# EAGLE design LC Meter PTH (EAGLE 9.6.2)
Assembly variants: DNP
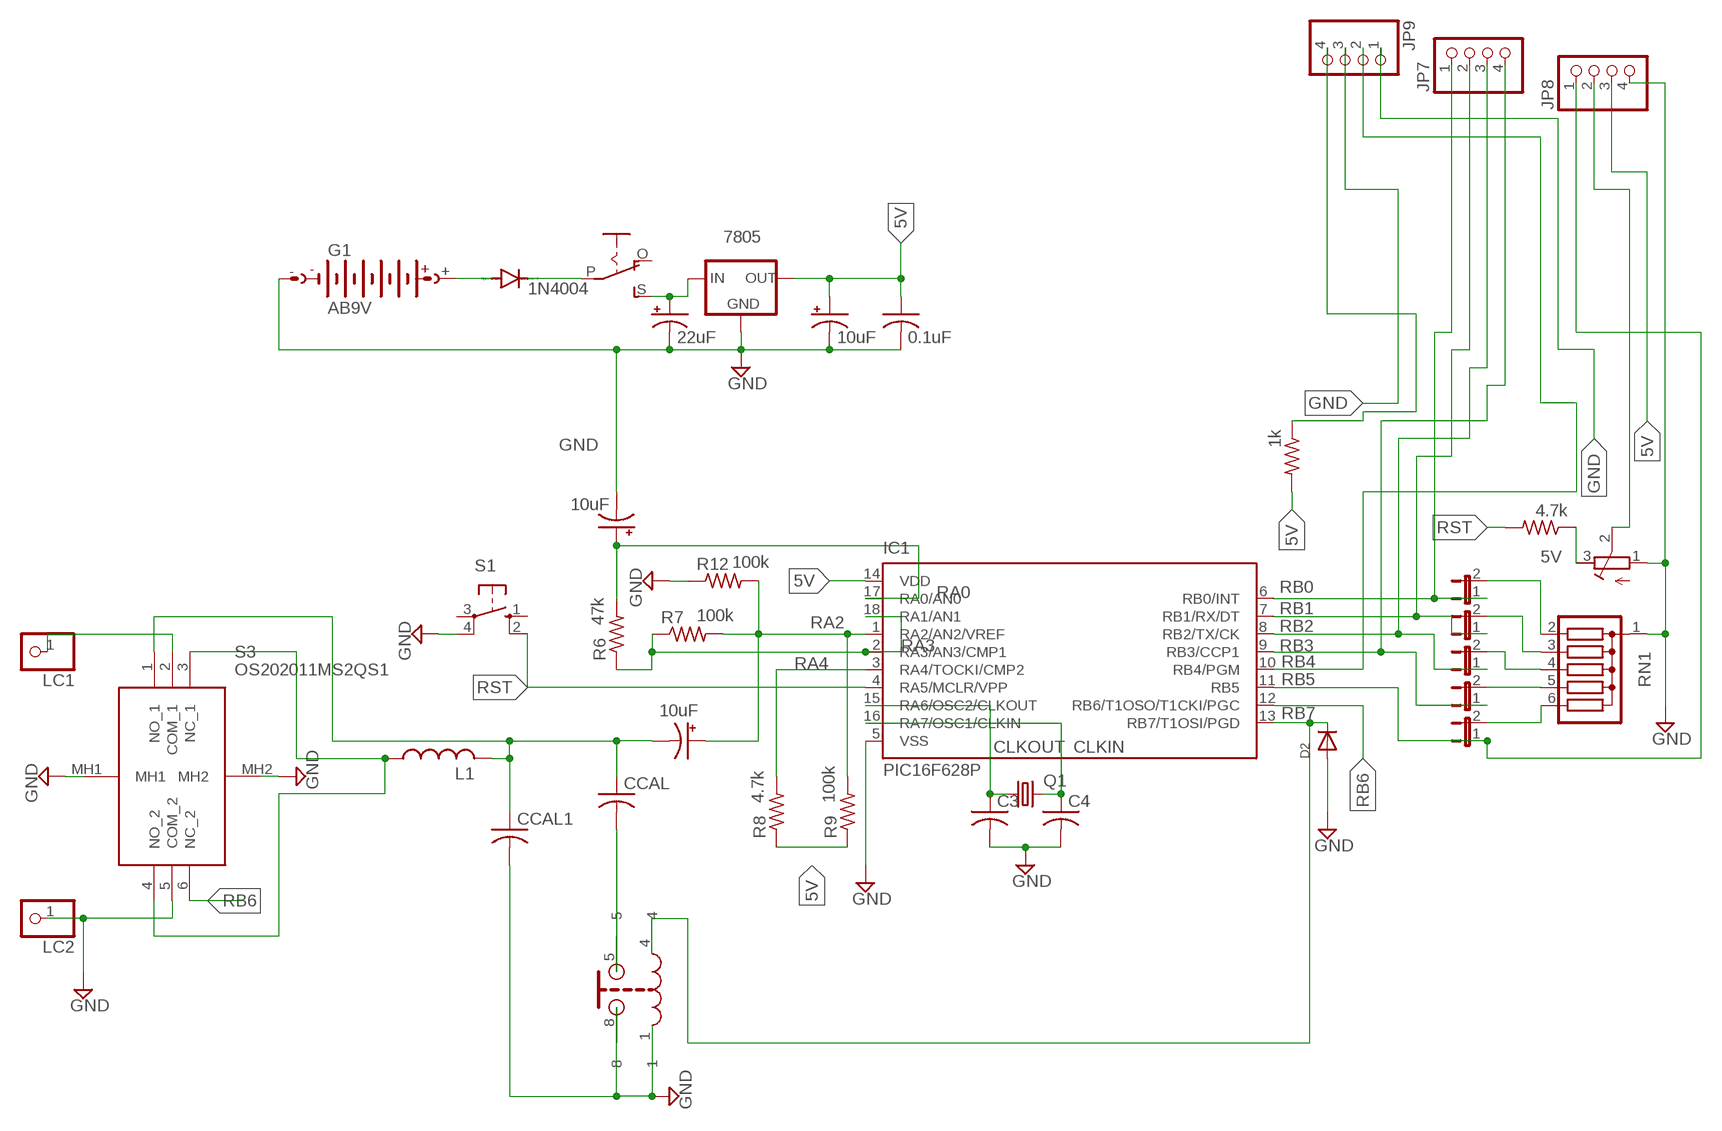
[diagram p0: schematic, sheet 1]

## Parts
C1  22uF  CPOL-USE2.5-7  [E2,5-7]
C2  0.1uF  C-US050-025X075  [C050-025X075]
C3  C-US025-030X050  [C025-030X050]
C4  C-US025-030X050  [C025-030X050]
C5  10uF  CPOL-USE2-4  [E2-4]
C6  10uF  CPOL-USE2-4  [E2-4]
C7  10uF  CPOL-USE2-4  [E2-4]
CCAL  C-US050-035X075  [C050-035X075]
CCAL1  C-US050-035X075  [C050-035X075]
D1  1N4004  [DO41-10]
D2  DIODEDO-1N4148  [DO-1N4148]
G1  AB9V  [AB9V]
IC1  PIC16F628P  [DIL18]
JP1  JP1E  [JP1]
JP2  JP1E  [JP1]
JP3  JP1E  [JP1]
JP4  JP1E  [JP1]
JP5  JP1E  [JP1]
JP7  PINHD-1X4  [1X04]
JP8  PINHD-1X4  [1X04]
JP9  PINHD-1X4  [1X04]
L1  L-US0207/12  [0207/12]
LC1  PINHD-1X1  [1X01]
LC2  PINHD-1X1  [1X01]
Q1  CRYSTALHC49S  [HC49/S]
R1  1k  R-US_0207/7  [0207/7]
R6  47k  R-US_0207/7  [0207/7]
R7  100k  R-US_0207/7  [0207/7]
R8  4.7k  R-US_0207/7  [0207/7]
R9  100k  R-US_0207/7  [0207/7]
R10  4.7k  R-US_0207/7  [0207/7]
R11  R-TRIMM3339P  [RTRIM3339P]
R12  100k  R-US_0207/7  [0207/7]
REED  REEDRELAY  [COTO2204]
RN1  G05R  [SIL6]
S1  10-XX  [B3F-10XX]
S2  EG1218S  [EG1218]
S3  OS202011MS2QS1  [OS202011MS2QS1]
VREG  7805  78XXS  [78XXS]

## Nets
5V: C2.1 C6.+ IC1.14(VDD) JP8.3 R1.2 R8.1 R9.1 R10.1 R11.3(E) VREG.OUT
CLKIN: C4.1 IC1.16(RA7/OSC1/CLKIN) Q1.2
CLKOUT: C3.1 IC1.15(RA6/OSC2/CLKOUT) Q1.1
GND: C1.- C2.2 C3.2 C4.2 C6.- C7.- CCAL1.2 D2.A G1.- IC1.5(VSS) JP8.4 JP9.1 JP9.3 LC2.1 R11.1(A) R12.1 REED.1 REED.8 RN1.1 S1.4(P1) S3.5(COM_2) S3.MH1 S3.MH2 VREG.GND
N$1: JP5.2 RN1.6
N$2: CCAL.2 REED.5
N$3: C1.+ S2.S VREG.IN
N$4: D1.C S2.P
N$5: D1.A G1.+
N$7: C5.- CCAL1.1 CCAL.1 L1.2 S3.1(NO_1)
N$8: JP4.2 RN1.5
N$12: JP3.2 RN1.4
N$13: JP2.2 RN1.3
N$14: JP1.2 RN1.2
N$15: LC1.1 S3.2(COM_1)
N$22: L1.1 S3.3(NC_1) S3.4(NO_2)
N$23: JP8.2 R11.2(S)
N$31: JP9.4 R1.1
RA0: C7.+ IC1.17(RA0/AN0) R6.2
RA2: C5.+ IC1.1(RA2/AN2/VREF) R7.2 R9.2 R12.2
RA3: IC1.2(RA3/AN3/CMP1) IC1.18(RA1/AN1) R6.1 R7.1
RA4: IC1.3(RA4/TOCKI/CMP2) R8.2
RB0: IC1.6(RB0/INT) JP1.1 JP7.1
RB1: IC1.7(RB1/RX/DT) JP2.1 JP7.2
RB2: IC1.8(RB2/TX/CK) JP3.1 JP7.3
RB3: IC1.9(RB3/CCP1) JP4.1 JP7.4
RB4: IC1.10(RB4/PGM) JP9.2
RB5: IC1.11(RB5) JP5.1 JP8.1
RB6: IC1.12(RB6/T1OSO/T1CKI/PGC) S3.6(NC_2)
RB7: D2.C IC1.13(RB7/T1OSI/PGD) REED.4
RST: IC1.4(RA5/MCLR/VPP) R10.2 S1.2(S1)
Unconnected: S1.1(S) S1.3(P) S2.O

## Library data of the parts
C1 = adafruit:CPOL-US: POLARIZED CAPACITOR, American symbol
C2-C4 CCAL CCAL1 = rcl:C-US: CAPACITOR, American symbol; SPICEPREFIX: C
C5-C7 = rcl:CPOL-US: POLARIZED CAPACITOR, American symbol; SPICEPREFIX: C
D1 = diode:1N4004: DIODE general purpose rectifier, 1 A
D2 = adafruit:DIODE: Diode SMADIODE - SMA Surface Mount Package 20V 1A Schottky Diode Digikey: 641-1014-6-ND DO-1N4148 - Through Hole Small Current Diode SOD-123 20V 1 A (.5mV Vf) Schottky Diode - Digikey: MBRX120TPMSCT-ND SOD-323 10V 570mA (.38mV Vf, 3ns) Schottky Diode - Digikey: ZLLS410CT-ND SOD-523 30V 30mA Schottky Diode (RB751S-40TE61) - Digikey: RB751S-40TE61CT-ND SOT23-R/W - SOT23 Package (R = Solder Paste/Reflow Ovens, W = Hand-Soldering) BAT54Film 40V 300mA - Digikey: 497-7162-1-ND
G1 = battery:AB9V: 9-V BATTERY CLIP
IC1 = microchip:PIC16F62*: FLASH-Based 8-Bit CMOS Microcontroller Source: http://ww1.microchip.com/downloads/en/DeviceDoc/40300C.pdf; MF: MICROCHIP; MPN: PIC16F628-04I/P; OC_FARNELL: 9760407; OC_NEWARK: 19C7272
JP1-JP5 = jumper:JP1E: JUMPER
JP7-JP9 = pinhead:PINHD-1X4: PIN HEADER
L1 = rcl:L-US: INDUCTOR, American symbol; SPICEPREFIX: L
LC1 LC2 = adafruit:PINHD-1X1: Pin header 1x1 for 0.1" spacing With round pins
Q1 = adafruit:CRYSTAL: CRYSTAL; OC_FARNELL: 1667008; OC_NEWARK: unknown
R1 R6-R10 R12 = rcl:R-US_: RESISTOR, American symbol; SPICEPREFIX: R
R11 = Custom Parts:R-TRIMM: Trimm resistor; SPICEMODEL: X; SPICEPREFIXL: POT
REED = Custom Parts:REEDRELAY
RN1 = resistor-sil:G05R: SIL RESISTOR; OC_FARNELL: unknown; OC_NEWARK: unknown
S1 = switch-omron:10-XX: OMRON SWITCH; MPN: B3F-1000; OC_FARNELL: 176432; OC_NEWARK: 36M3542
S2 = adafruit:EG1218: SLIDING SWITCH 0.1" spacing through hole, vertical SPDT slide switch http://www.ladyada.net/library/pcb/eaglelibrary.html
S3 = OS202011MS2QS1:OS202011MS2QS1: Switch Slide ON ON DPDT Top Slide 0.1A 12VDC 10000Cycles PC Pins Bracket Mount/Through Hole Bulk Source: Datasheet <https://www.mouser.com/datasheet/2/60/os-1382783.pdf>; ARROW_PART_NUMBER: OS202011MS2QS1; ARROW_PRICE-STOCK: https://www.arrow.com/en/products/os202011ms2qs1/ck; DESCRIPTION: Switch Slide ON ON DPDT Top Slide 0.1A 12VDC 10000Cycles PC Pins Bracket Mount/Through Hole Bulk; HEIGHT: 8.7mm; MANUFACTURER_NAME: C & K COMPONENTS; MANUFACTURER_PART_NUMBER: OS202011MS2QS1; MOUSER_PART_NUMBER: 611-OS202011MS2QS1; MOUSER_PRICE-STOCK: https://www.mouser.co.uk/ProductDetail/CK/OS202011MS2QS1/?qs=86ySKn7Oc5UsfQ5%2FN%252BBOEA%3D%3D
VREG = v-reg:78XXS: VOLTAGE REGULATOR

## Board
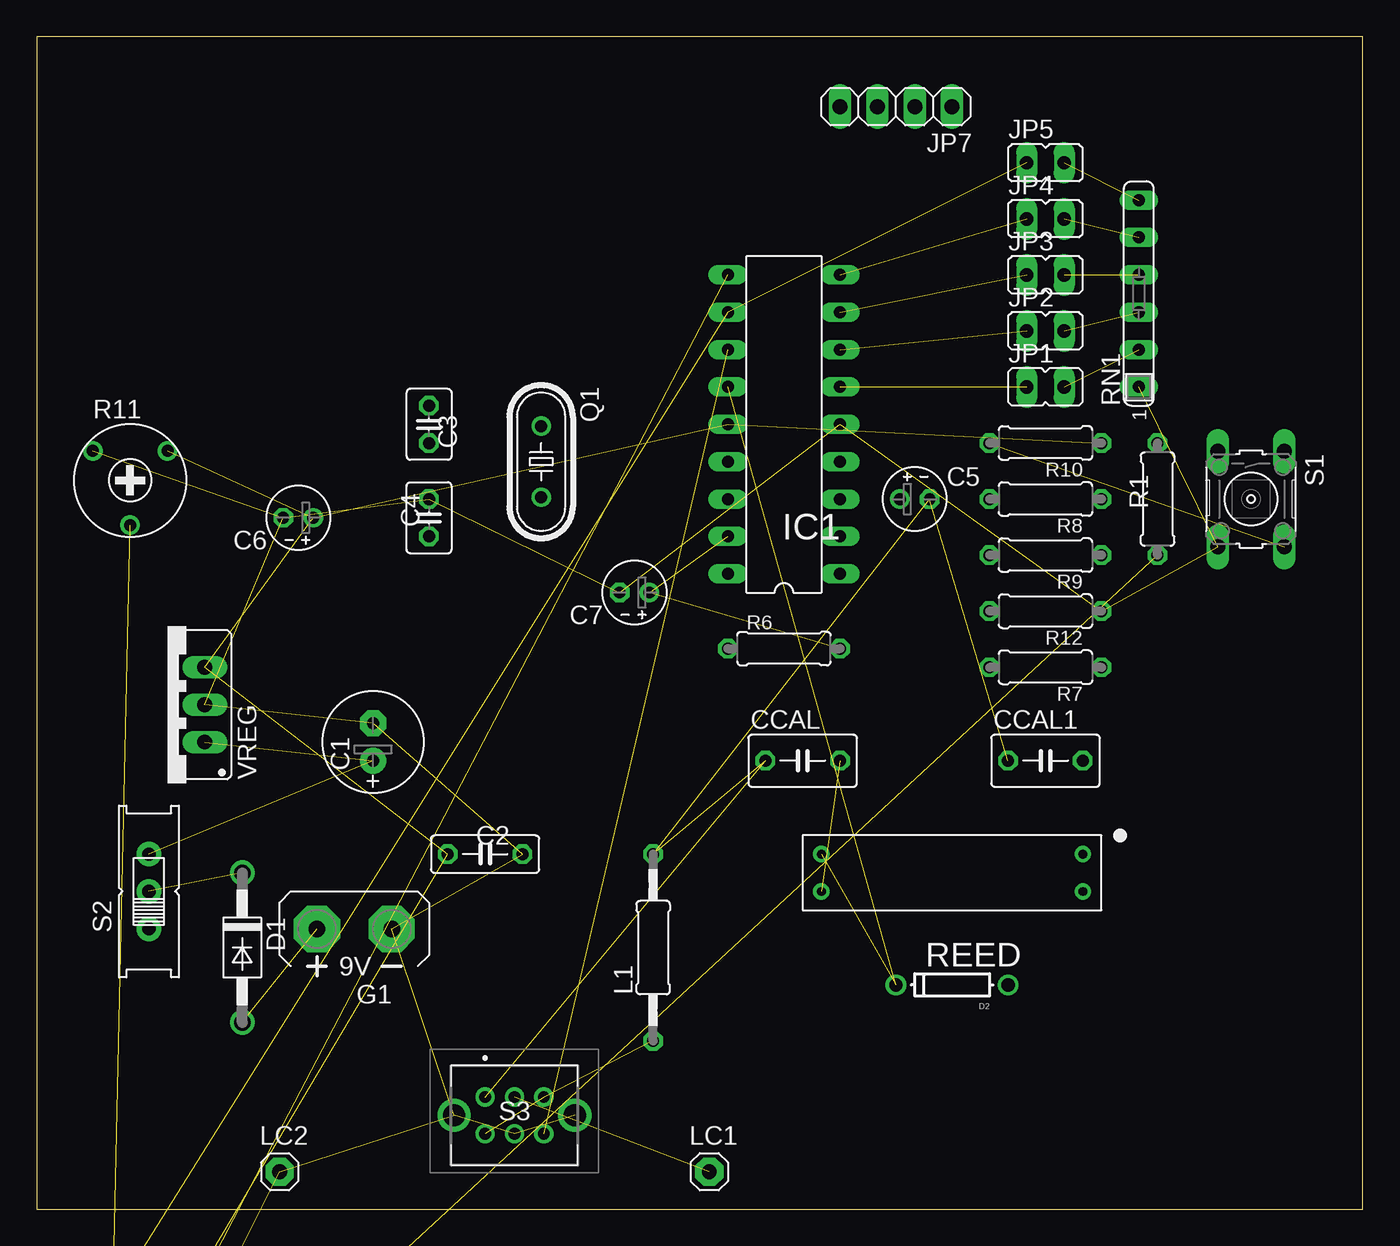
[diagram p1: board, top side]
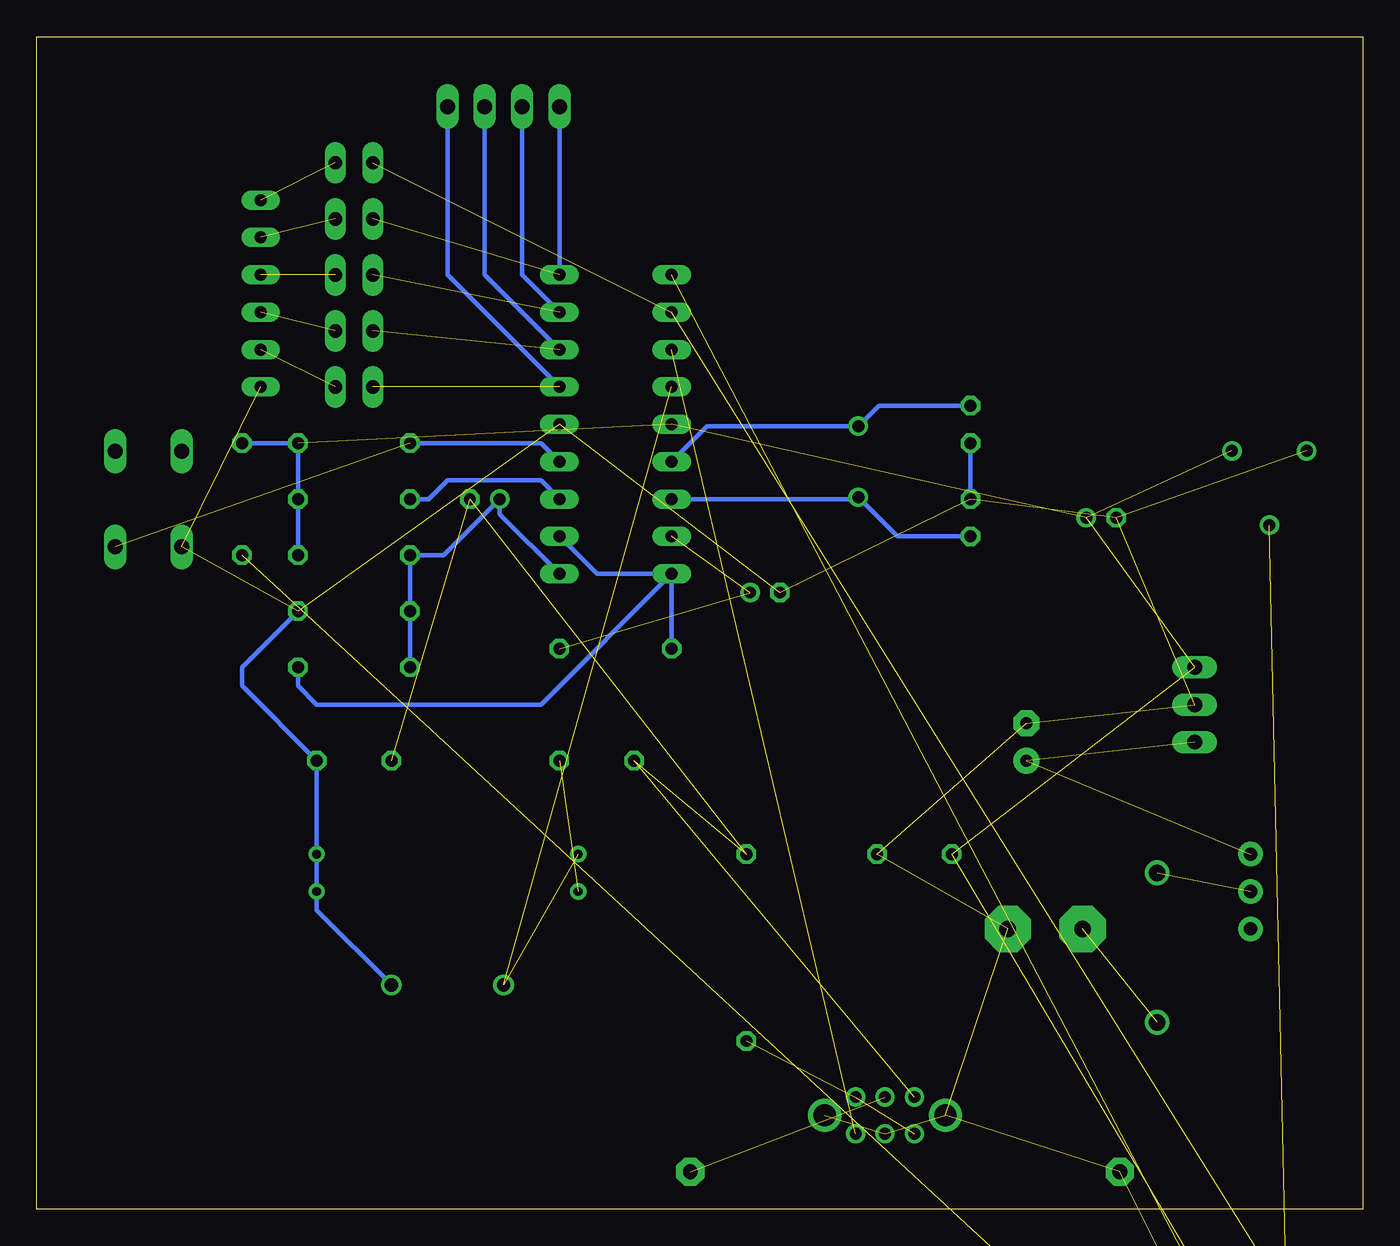
[diagram p2: board, bottom side, seen from below]

Size 90.15 x 79.68 mm. Coordinates in mm from the lower left corner, seen from the top.
Outline: 0,0 90.15,0 90.15,79.68 0,79.68 0,0
Copper layers (1*16): Top 0.035mm / dielectric 1.5mm / Bottom 0.035mm
Design rules "default": minimum track width 6mil, minimum drill 0.35mm, track to track 6mil, track to pad 6mil, pad to pad 6mil, via to via 6mil, smd to smd 6mil, copper to edge 40mil, drill to drill 6mil, minimum pad ring 10mil, minimum via ring 8mil, stop-mask expansion 4mil, vias tented up to drill 0mil, thermal gap 10mil

### Footprints (pad centres in the part's own frame; a part is rotated, then mirrored left to right if it is on the bottom)
E2,5-7 = drill 0.813 pad 1.778: + -1.27,0 | drill 0.813 pad 1.778 octagon: - 1.27,0
C050-025X075 = drill 0.813 octagon: 1 -2.54,0; 2 2.54,0
C025-030X050 = drill 0.813 octagon: 1 -1.27,0; 2 1.27,0
E2-4 = drill 0.813 pad 1.27: + -1.016,0 | drill 0.813 pad 1.27 octagon: - 1.016,0
C050-035X075 = drill 0.813 octagon: 1 -2.54,0; 2 2.54,0
DO41-10 = drill 1.118: A 5.08,0; C -5.08,0
DO-1N4148 = drill 0.9: A -3.81,0; C 3.81,0
AB9V = drill 1.118 pad 3.15 octagon: + 0,2.54; - 0,-2.54
DIL18 = drill 0.813 long: 1 -10.16,-3.81; 2 -7.62,-3.81; 3 -5.08,-3.81; 4 -2.54,-3.81; 5 0,-3.81; 6 2.54,-3.81; 7 5.08,-3.81; 8 7.62,-3.81; 9 10.16,-3.81; 10 10.16,3.81; 11 7.62,3.81; 12 5.08,3.81; 13 2.54,3.81; 14 0,3.81; 15 -2.54,3.81; 16 -5.08,3.81; 17 -7.62,3.81; 18 -10.16,3.81
JP1 = drill 0.914 long: 1 0,-1.27; 2 0,1.27
1X04 = drill 1.016 long: 1 -3.81,0; 2 -1.27,0; 3 1.27,0; 4 3.81,0
0207/12 = drill 0.813 octagon: 1 -6.35,0; 2 6.35,0
1X01 = drill 1.016 pad 1.93 octagon: 1 0,0
HC49/S = drill 0.813: 1 -2.413,0; 2 2.413,0
0207/7 = drill 0.813 octagon: 1 -3.81,0; 2 3.81,0
RTRIM3339P = drill 0.813: 1 -2.54,2; 2 0,-3.04; 3 2.54,2
COTO2204 = drill 0.6: 1 -8.89,-1.27; 4 8.89,-1.27; 5 8.89,1.27; 8 -8.89,1.27
SIL6 = drill 0.813 long: 1 -6.35,0; 2 -3.81,0; 3 -1.27,0; 4 1.27,0; 5 3.81,0; 6 6.35,0
B3F-10XX = drill 1.016 long: 1 -3.251,2.261; 2 3.251,2.261; 3 -3.251,-2.261; 4 3.251,-2.261
EG1218 = drill 0.9 pad 1.676: O -2.54,0; P 0,0; S 2.54,0
OS202011MS2QS1 = drill 0.8 pad 1.3: 1 0,0; 2 2,0; 3 4,0; 4 0,-2.5; 5 2,-2.5; 6 4,-2.5 | drill 1.5 pad 2.25: MH1 -2.1,-1.25; MH2 6.1,-1.25
78XXS = drill 1.016 long: GND 0,-2.54; IN -2.54,-2.54; OUT 2.54,-2.54

### Placement (x,y rotation side)
C1  22.86,31.75 90 top
C2  30.48,24.13 0 top
C3  26.67,53.34 270 top
C4  26.67,46.99 90 top
C5  59.69,48.26 0 top
C6  17.78,46.99 180 top
C7  40.64,41.91 180 top
CCAL  52.07,30.48 0 top
CCAL1  68.58,30.48 0 top
D1  13.97,17.78 270 top
D2  62.23,15.24 180 top
G1  21.59,19.05 90 top
IC1  50.8,53.34 90 top
JP1  68.58,55.88 270 top
JP2  68.58,59.69 270 top
JP3  68.58,63.5 270 top
JP4  68.58,67.31 270 top
JP5  68.58,71.12 270 top
JP7  58.42,74.93 180 top
JP8  6.35,-10.16 0 top  (outside the outline)
JP9  6.35,-16.51 0 top  (outside the outline)
L1  41.91,17.78 90 top
LC1  45.72,2.54 0 top
LC2  16.51,2.54 0 top
Q1  34.29,50.8 270 top
R1  76.2,48.26 90 top
R6  50.8,38.1 0 top
R7  68.58,36.83 180 top
R8  68.58,48.26 180 top
R9  68.58,44.45 180 top
R10  68.58,52.07 180 top
R11  6.35,49.53 0 top
R12  68.58,40.64 180 top
REED  62.23,22.86 180 top
RN1  74.93,62.23 90 top
S1  82.55,48.26 270 top
S2  7.62,21.59 90 top
S3  30.48,7.62 0 top
VREG  8.89,34.29 90 top

### Tracks (layer width: path | path; a pad name or v marks a point on that pad's centre or on a via)
5V  (6 unrouted)
  Bottom 0.305: R1.2 R10.1 R8.1 R9.1
CLKIN
  Bottom 0.305: C4.1 31.62,45.72 Q1.2 34.42,48.26 IC1.16
CLKOUT
  Bottom 0.305: C3.1 32.89,54.61 Q1.1 44.58,53.21 IC1.15
GND  (18 unrouted)
  Bottom 0.305: C4.2 C3.2 | D2.A 71.12,20.32 REED.8 REED.1 CCAL1.2 76.2,35.56 76.2,36.83 R12.1
N$1  (1 unrouted)
N$2  (1 unrouted)
N$3  (2 unrouted)
N$4  (1 unrouted)
N$5  (1 unrouted)
N$7  (4 unrouted)
N$8  (1 unrouted)
N$12  (1 unrouted)
N$13  (1 unrouted)
N$14  (1 unrouted)
N$15  (1 unrouted)
N$22  (2 unrouted)
N$23  (1 unrouted)
N$31  (1 unrouted)
RA0  (2 unrouted)
RA2
  Bottom 0.305: IC1.1 58.67,47.24 C5.+ 62.48,44.45 R9.2 R12.2 R7.2
RA3
  Bottom 0.305: IC1.2 52.07,43.18 IC1.18 | R7.1 72.39,35.56 71.12,34.29 55.88,34.29 IC1.18 | R6.1 IC1.18
RA4
  Bottom 0.305: R8.2 63.5,48.26 62.23,49.53 55.88,49.53 IC1.3
RB0  (1 unrouted)
  Bottom 0.305: JP7.1 62.23,63.5 IC1.6
RB1  (1 unrouted)
  Bottom 0.305: JP7.2 59.69,63.5 IC1.7
RB2  (1 unrouted)
  Bottom 0.305: JP7.3 57.15,63.5 IC1.8
RB3  (1 unrouted)
  Bottom 0.305: JP7.4 IC1.9
RB4  (1 unrouted)
RB5  (2 unrouted)
RB6  (1 unrouted)
RB7  (2 unrouted)
RST  (1 unrouted)
  Bottom 0.305: R10.2 55.88,52.07 IC1.4